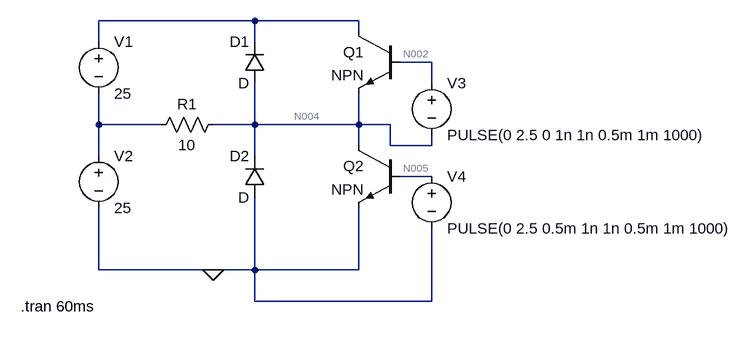
[diagram p0: schematic HALF_BRIDGE.asc]
HALF_BRIDGE.asc, the LTspice schematic file:
Version 4
SHEET 1 880 680
WIRE 96 -144 -144 -144
WIRE 256 -144 96 -144
WIRE 256 -128 256 -144
WIRE -144 -112 -144 -144
WIRE 96 -112 96 -144
WIRE 368 -80 320 -80
WIRE 368 -48 368 -80
WIRE -144 16 -144 -32
WIRE -48 16 -144 16
WIRE 96 16 96 -48
WIRE 96 16 32 16
WIRE 256 16 256 -32
WIRE 256 16 96 16
WIRE 304 16 256 16
WIRE 256 48 256 16
WIRE 304 48 304 16
WIRE 368 48 368 32
WIRE 368 48 304 48
WIRE -144 64 -144 16
WIRE 96 64 96 16
WIRE 368 96 320 96
WIRE -144 240 -144 144
WIRE 32 240 -144 240
WIRE 96 240 96 128
WIRE 96 240 32 240
WIRE 256 240 256 144
WIRE 256 240 96 240
WIRE 96 288 96 240
WIRE 368 288 368 176
WIRE 368 288 96 288
FLAG 32 240 0
SYMBOL voltage -144 -128 R0
WINDOW 123 0 0 Left 0
WINDOW 39 0 0 Left 0
SYMATTR InstName V1
SYMATTR Value 25
SYMBOL voltage -144 48 R0
WINDOW 123 0 0 Left 0
WINDOW 39 0 0 Left 0
SYMATTR InstName V2
SYMATTR Value 25
SYMBOL voltage 368 -64 R0
WINDOW 123 0 0 Left 0
WINDOW 39 0 0 Left 0
SYMATTR InstName V3
SYMATTR Value PULSE(0 2.5 0 1n 1n 0.5m 1m 1000)
SYMBOL diode 112 -48 R180
WINDOW 0 24 64 Left 2
WINDOW 3 24 0 Left 2
SYMATTR InstName D1
SYMBOL diode 112 128 R180
WINDOW 0 24 64 Left 2
WINDOW 3 24 0 Left 2
SYMATTR InstName D2
SYMBOL npn 320 -128 M0
SYMATTR InstName Q1
SYMBOL npn 320 48 M0
SYMATTR InstName Q2
SYMBOL res 48 0 R90
WINDOW 0 0 56 VBottom 2
WINDOW 3 32 56 VTop 2
SYMATTR InstName R1
SYMATTR Value 10
SYMBOL voltage 368 80 R0
WINDOW 123 0 0 Left 0
WINDOW 39 0 0 Left 0
SYMATTR InstName V4
SYMATTR Value PULSE(0 2.5 0.5m 1n 1n 0.5m 1m 1000)
TEXT -264 296 Left 2 !.tran 60ms

The netlist it stands for:
* HALF_BRIDGE.asc
V1 N001 N003 25
V2 N003 0 25
V3 N002 N004 PULSE(0 2.5 0 1n 1n 0.5m 1m 1000)
D1 N004 N001 D
D2 0 N004 D
Q1 N001 N002 N004 0 NPN
Q2 N004 N005 0 0 NPN
R1 N004 N003 10
V4 N005 0 PULSE(0 2.5 0.5m 1n 1n 0.5m 1m 1000)
.model D D
.lib standard.dio
.model NPN NPN
.model PNP PNP
.lib standard.bjt
.tran 60ms
.backanno
.end

* Results of the author's LTspice run, read from the files saved beside the schematic
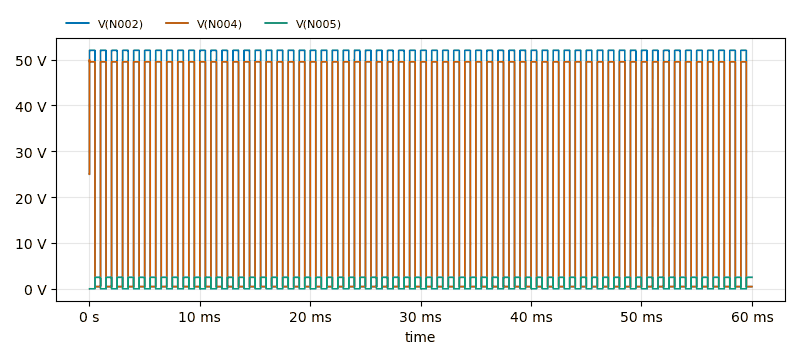
[diagram p1: Transient Analysis of HALF_BRIDGE.asc, plotted from the saved traces]
* Transient Analysis, 1 run:
*   V(N002): min 476.4 mV, max 52.02 V, average 26.25 V, rms 36.79 V, last 476.4 mV
*   V(N004): min 476.4 mV, max 49.97 V, average 25 V, rms 35.02 V, last 476.4 mV
*   V(N005): min 0 V, max 2.5 V, average 1.25 V, rms 1.768 V, last 2.5 V